# EasyEDA schematic 1-Schematic_PI Attenuator (SMD).json
TITLE: PI Attenuator (SMD): Main module; REV: 4.0.EE; Date: 2020-09-28; Sheet: 1/1; Drawn By: IgrikXD
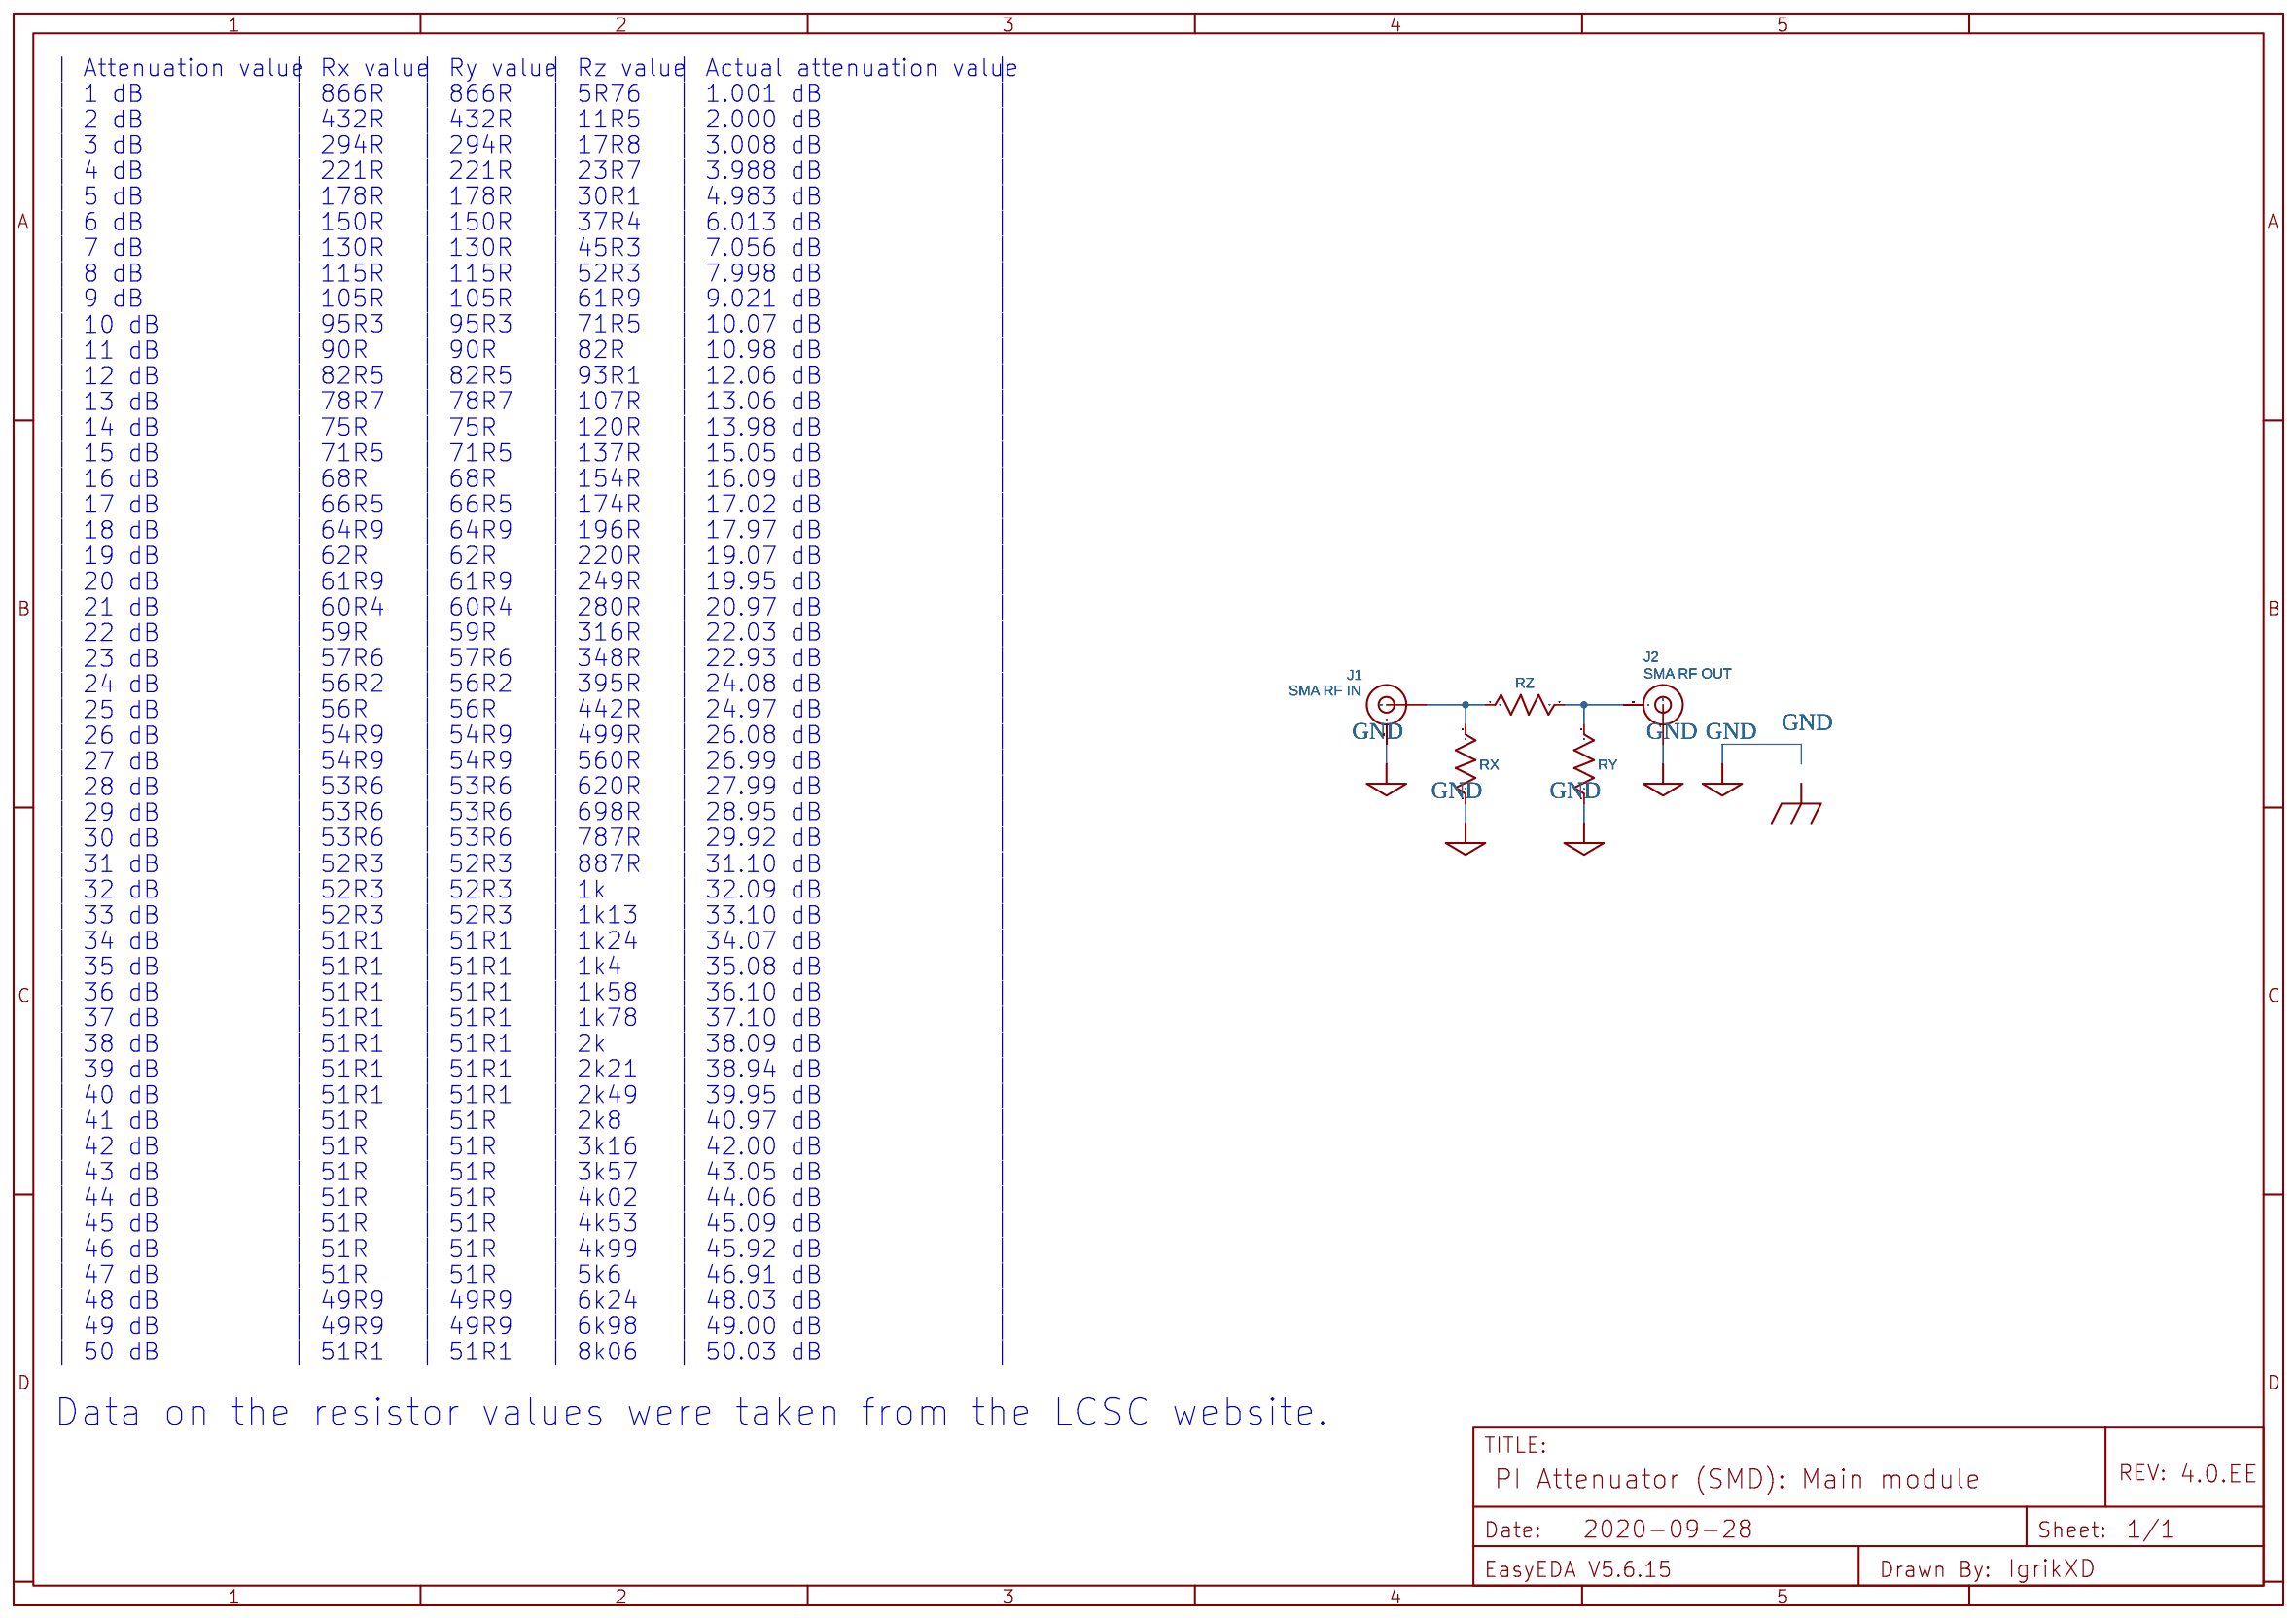
[diagram p0: schematic sheet]

## Parts
J1  SMA RF IN  [SMA-EDGE]
J2  SMA RF OUT  [SMA-EDGE]
RX  CALCULATED  [0805 WITHOUT MASK]
RY  CALCULATED  [0805 WITHOUT MASK]
RZ  CALCULATED  [0805 WITHOUT MASK]

## Library data of the parts
J1 J2 = -: Contributor: IgrikXD; Manufacturer Part: ANKX01.0093; Supplier Part: C129604; Supplier: LCSC; Manufacturer: RFsister
RX RY RZ = Res_0805(1/8W)_US: Manufacturer Part: NULL

## Nets
GND: J1.GND@0(GND) J1.GND@1(GND) J1.GND@2(GND) J1.GND@3(GND) J2.SIG(SIGNAL) RX.1 RY.1
Net-(J1-SIG): J1.SIG(SIGNAL) RX.2 RZ.1
Net-(J2-GND@0): J2.GND@0(GND) J2.GND@1(GND) J2.GND@2(GND) J2.GND@3(GND) RY.2 RZ.2

## Notes on the sheet
- | Attenuation value
- | Rx value
- | Ry value
- | Rz value
- | Actual attenuation value
- |
- | 1 dB
- | 866R
- | 866R
- | 5R76
- | 1.001 dB
- |
- | 2 dB
- | 432R
- | 432R
- | 11R5
- | 2.000 dB
- |
- | 3 dB
- | 294R
- | 294R
- | 17R8
- | 3.008 dB
- |
- | 4 dB
- | 221R
- | 221R
- | 23R7
- | 3.988 dB
- |
- | 5 dB
- | 178R
- | 178R
- | 30R1
- | 4.983 dB
- |
- | 6 dB
- | 150R
- | 150R
- | 37R4
- | 6.013 dB
- |
- | 7 dB
- | 130R
- | 130R
- | 45R3
- | 7.056 dB
- |
- | 8 dB
- | 115R
- | 115R
- | 52R3
- | 7.998 dB
- |
- | 9 dB
- | 105R
- | 105R
- | 61R9
- | 9.021 dB
- |
- | 10 dB
- | 95R3
- | 95R3
- | 71R5
- | 10.07 dB
- |
- | 11 dB
- | 90R
- | 90R
- | 82R
- | 10.98 dB
- |
- | 12 dB
- | 82R5
- | 82R5
- | 93R1
- | 12.06 dB
- |
- | 13 dB
- | 78R7
- | 78R7
- | 107R
- | 13.06 dB
- |
- | 14 dB
- | 75R
- | 75R
- | 120R
- | 13.98 dB
- |
- | 15 dB
- | 71R5
- | 71R5
- | 137R
- | 15.05 dB
- |
- | 16 dB
- | 68R
- | 68R
- | 154R
- | 16.09 dB
- |
- | 17 dB
- | 66R5
- | 66R5
- | 174R
- | 17.02 dB
- |
- | 18 dB
- | 64R9
- | 64R9
- | 196R
- | 17.97 dB
- |
- | 19 dB
- | 62R
- | 62R
- | 220R
- | 19.07 dB
- |
- | 20 dB
- | 61R9
- | 61R9
- | 249R
- | 19.95 dB
- |
- | 21 dB
- | 60R4
- | 60R4
- | 280R
- | 20.97 dB
- |
- | 22 dB
- | 59R
- | 59R
- | 316R
- | 22.03 dB
- |
- | 23 dB
- | 57R6
- | 57R6
- | 348R
- | 22.93 dB
- |
- | 24 dB
- | 56R2
- | 56R2
- | 395R
- | 24.08 dB
- |
- | 56R
- | 56R
- | 442R
- | 24.97 dB
- |
- | 25 dB
- | 26 dB
- | 54R9
- | 54R9
- | 499R
- | 26.08 dB
- |
- | 27 dB
- | 54R9
- | 54R9
- | 560R
- | 26.99 dB
- |
- | 28 dB
- | 53R6
- | 53R6
- | 620R
- | 27.99 dB
- |
- | 29 dB
- | 53R6
- | 53R6
- | 698R
- | 28.95 dB
- |
- | 30 dB
- | 53R6
- | 53R6
- | 787R
- | 29.92 dB
- |
- | 31 dB
- | 52R3
- | 52R3
- | 887R
- | 31.10 dB
- |
- | 32 dB
- | 52R3
- | 52R3
- | 1k
- | 32.09 dB
- |
- | 33 dB
- | 52R3
- | 52R3
- | 1k13
- | 33.10 dB
- |
- | 34 dB
- | 51R1
- | 51R1
- | 1k24
- | 34.07 dB
- |
- | 35 dB
- | 51R1
- | 51R1
- | 1k4
- | 35.08 dB
- |
- | 36 dB
- | 51R1
- | 51R1
- | 1k58
- | 36.10 dB
- |
- | 37 dB
- | 51R1
- | 51R1
- | 1k78
- | 37.10 dB
- |
- | 38 dB
- | 51R1
- | 51R1
- | 2k
- | 38.09 dB
- |
- | 39 dB
- | 51R1
- | 51R1
- | 2k21
- | 38.94 dB
- |
- | 40 dB
- | 51R1
- | 51R1
- | 2k49
- | 39.95 dB
- |
- | 41 dB
- | 51R
- | 51R
- | 2k8
- | 40.97 dB
- |
- | 42 dB
- | 51R
- | 51R
- | 3k16
- | 42.00 dB
- |
- | 43 dB
- | 51R
- | 51R
- | 3k57
- | 43.05 dB
- |
- | 44 dB
- | 51R
- | 51R
- | 4k02
- | 44.06 dB
- |
- | 45 dB
- | 51R
- | 51R
- | 4k53
- | 45.09 dB
- |
- | 46 dB
- | 51R
- | 51R
- | 4k99
- | 45.92 dB
- |
- | 47 dB
- | 51R
- | 51R
- | 5k6
- | 46.91 dB
- |
- | 48 dB
- | 49R9
- | 49R9
- | 6k24
- | 48.03 dB
- |
- | 49 dB
- | 49R9
- | 49R9
- | 6k98
- | 49.00 dB
- |
- | 50 dB
- | 51R1
- | 51R1
- | 8k06
- | 50.03 dB
- |
- Data on the resistor values were taken from the LCSC website.
